# EAGLE schematic EE-Workshop (EAGLE 9.2.2)
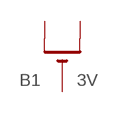
[diagram p0: schematic, sheet 1]

## Parts
B1  3V  CR1220THM  [CR1220-THM]
Unconnected: B1.+1(+) B1.+2(+1) B1.-

## Library data of the parts
B1 = adafruit:CR1220: CR1216/CR1220/CR1225 12mm 3V lithium coin cell Great for battery packup. Both SMT and THM holders. Note the THM package has the ground pads on both sides of the PCB so that the masks are the same - this reduces the cost; SPICEPREFIX: J